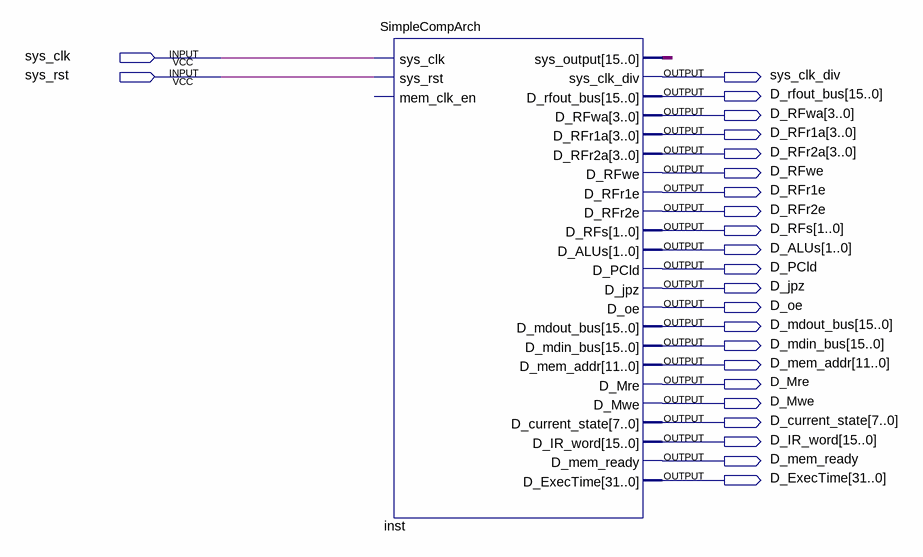
[diagram p0: schematic sheet]
// Quartus schematic SimpleCompArch_Block.bdf as structural Verilog: 1 symbols, 24 pins
module SimpleCompArch_Block (
  input  sys_clk,
  input  sys_rst,
  output sys_clk_div,
  output [15:0] D_rfout_bus,
  output [3:0] D_RFwa,
  output [3:0] D_RFr1a,
  output [3:0] D_RFr2a,
  output D_RFwe,
  output D_RFr1e,
  output D_RFr2e,
  output [1:0] D_RFs,
  output [1:0] D_ALUs,
  output D_PCld,
  output D_jpz,
  output D_oe,
  output [15:0] D_mdout_bus,
  output [15:0] D_mdin_bus,
  output [11:0] D_mem_addr,
  output D_Mre,
  output D_Mwe,
  output [7:0] D_current_state,
  output [15:0] D_IR_word,
  output D_mem_ready,
  output [31:0] D_ExecTime
);

  wire [15:0] inst_sys_output;

  SimpleCompArch inst (
    .sys_clk(sys_clk), .sys_rst(sys_rst), .sys_output(inst_sys_output), .sys_clk_div(sys_clk_div),
    .D_rfout_bus(D_rfout_bus), .D_RFwa(D_RFwa), .D_RFr1a(D_RFr1a), .D_RFr2a(D_RFr2a), .D_RFwe(D_RFwe),
    .D_RFr1e(D_RFr1e), .D_RFr2e(D_RFr2e), .D_RFs(D_RFs), .D_ALUs(D_ALUs), .D_PCld(D_PCld), .D_jpz(D_jpz),
    .D_oe(D_oe), .D_mdout_bus(D_mdout_bus), .D_mdin_bus(D_mdin_bus), .D_mem_addr(D_mem_addr), .D_Mre(D_Mre),
    .D_Mwe(D_Mwe), .D_current_state(D_current_state), .D_IR_word(D_IR_word), .D_mem_ready(D_mem_ready),
    .D_ExecTime(D_ExecTime));  // open: mem_clk_en
endmodule
